# Altium schematic sheet Mechanical.SchDoc
size A; SheetNumber: 3; SheetTotal: 3
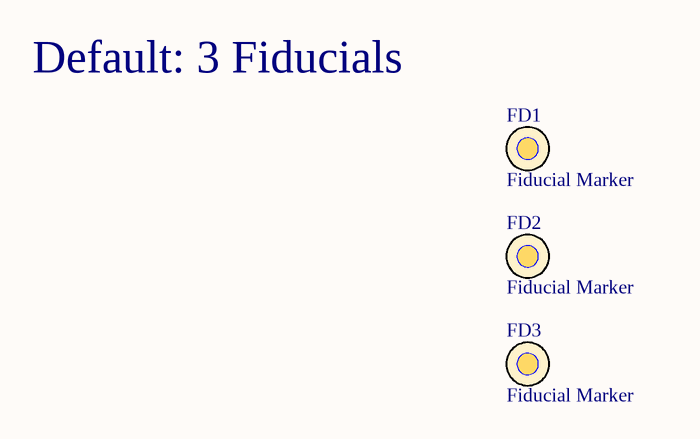
[diagram p0: Mechanical.SchDoc]

## Parts
FD1  Fiducial Marker  [FIDUCIAL]
FD2  Fiducial Marker  [FIDUCIAL]
FD3  Fiducial Marker  [FIDUCIAL]

## Notes on the sheet
- (near FD1) Default: 3 Fiducials

## Library data of the parts
FD1-FD3 = Fiducial